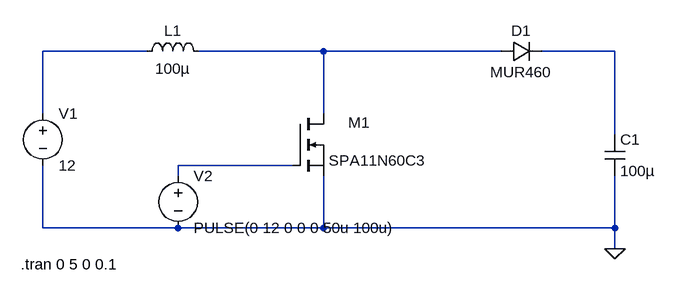
[diagram p0: schematic boost-sim.asc]
boost-sim.asc, the LTspice schematic file:
Version 4
SHEET 1 904 680
WIRE -80 32 -240 32
WIRE 192 32 0 32
WIRE 464 32 192 32
WIRE 640 32 528 32
WIRE -240 128 -240 32
WIRE 192 128 192 32
WIRE 640 160 640 32
WIRE 144 208 -32 208
WIRE -32 224 -32 208
WIRE -240 304 -240 208
WIRE -32 304 -240 304
WIRE 192 304 192 224
WIRE 192 304 -32 304
WIRE 640 304 640 224
WIRE 640 304 192 304
WIRE 640 336 640 304
FLAG 640 336 0
SYMBOL nmos 144 128 R0
WINDOW 0 86 14 Left 2
SYMATTR InstName M1
SYMATTR Value SPA11N60C3
SYMBOL ind -96 48 R270
WINDOW 0 32 56 VTop 2
WINDOW 3 5 56 VBottom 2
SYMATTR InstName L1
SYMATTR Value 100µ
SYMATTR SpiceLine Rser=0.042
SYMBOL diode 464 48 R270
WINDOW 0 32 32 VTop 2
WINDOW 3 0 32 VBottom 2
SYMATTR InstName D1
SYMATTR Value MUR460
SYMBOL cap 624 160 R0
SYMATTR InstName C1
SYMATTR Value 100µ
SYMATTR SpiceLine Rser=0.13
SYMBOL voltage -240 112 R0
WINDOW 123 0 0 Left 0
WINDOW 39 0 0 Left 0
SYMATTR InstName V1
SYMATTR Value 12
SYMBOL voltage -32 208 R0
WINDOW 123 0 0 Left 0
WINDOW 39 0 0 Left 0
SYMATTR InstName V2
SYMATTR Value PULSE(0 12 0 0 0 50u 100u)
TEXT -274 360 Left 2 !.tran 0 5 0 0.1

The netlist it stands for:
* boost-sim.asc
M1 N002 N004 0 0 SPA11N60C3
L1 N001 N002 100µ Rser=0.042
D1 N002 N003 MUR460
C1 N003 0 100µ Rser=0.13
V1 N001 0 12
V2 N004 0 PULSE(0 12 0 0 0 50u 100u)
.model D D
.lib standard.dio
.model NMOS NMOS
.model PMOS PMOS
.lib standard.mos
.tran 0 5 0 0.1
.backanno
.end